# EAGLE design pcb-meter (EAGLE 7.4.0)
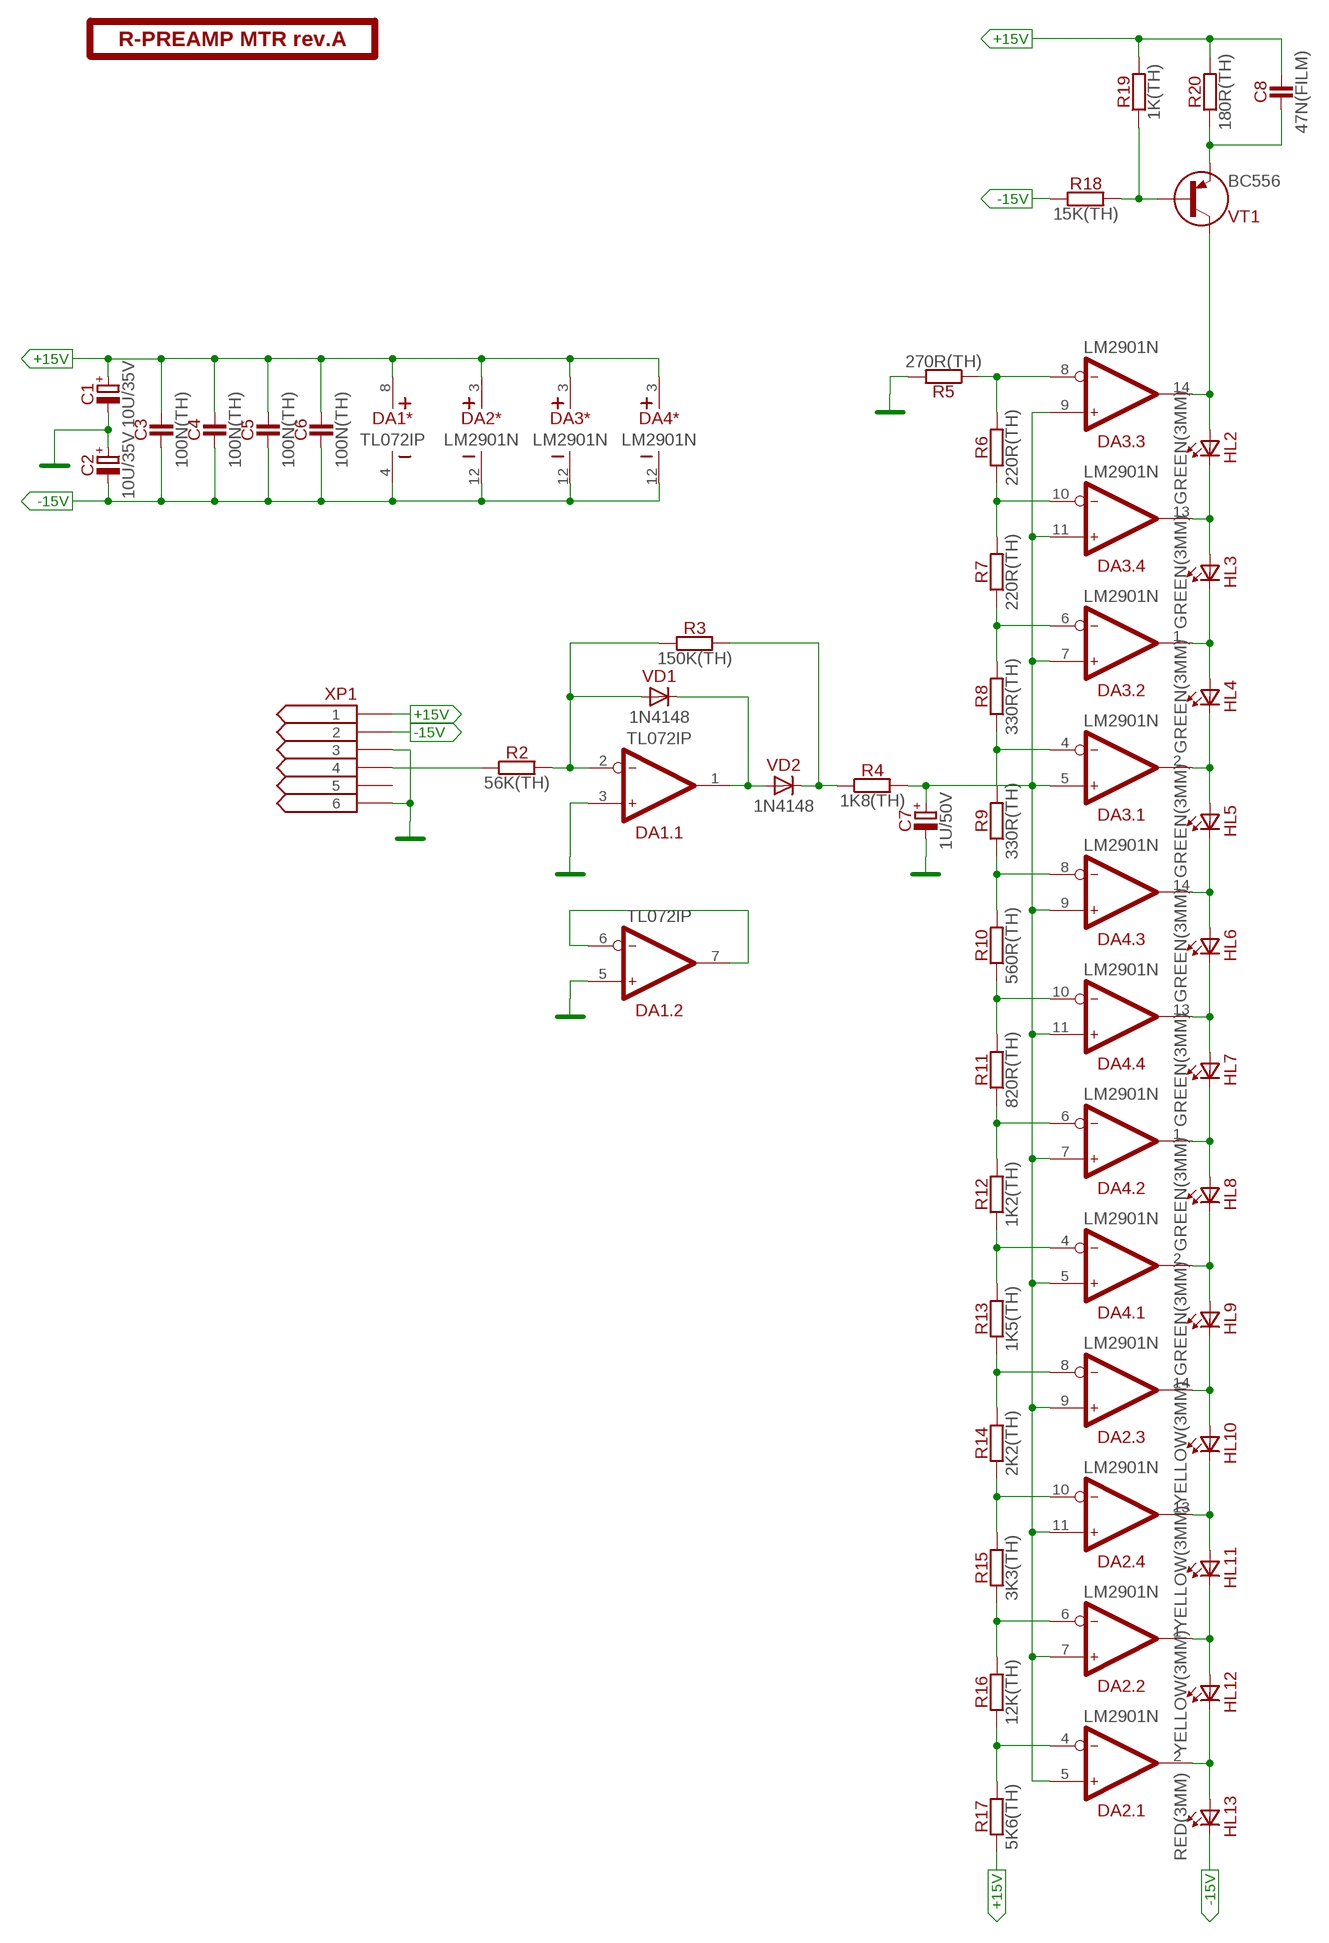
[diagram p0: schematic, sheet 1]

## Parts
C1  10U/35V  [E2-5]
C2  10U/35V  [E2-5]
C3  100N(TH)  [C050-024X044]
C4  100N(TH)  [C050-024X044]
C5  100N(TH)  [C050-024X044]
C6  100N(TH)  [C050-024X044]
C7  1U/50V  [E1,5-4]
C8  47N(FILM)  [C050-025X075]
DA1  TL072IP  [DIP-8]
DA2  LM2901N  [DIP-14]
DA3  LM2901N  [DIP-14]
DA4  LM2901N  [DIP-14]
HL2  GREEN(3MM)  [LED3MM-H]
HL3  GREEN(3MM)  [LED3MM-H]
HL4  GREEN(3MM)  [LED3MM-H]
HL5  GREEN(3MM)  [LED3MM-H]
HL6  GREEN(3MM)  [LED3MM-H]
HL7  GREEN(3MM)  [LED3MM-H]
HL8  GREEN(3MM)  [LED3MM-H]
HL9  GREEN(3MM)  [LED3MM-H]
HL10  YELLOW(3MM)  [LED3MM-H]
HL11  YELLOW(3MM)  [LED3MM-H]
HL12  YELLOW(3MM)  [LED3MM-H]
HL13  RED(3MM)  [LED3MM-H]
PCB1  R-PREAMP MTR rev.A  GENERIC-LOGO  [F-LOGO]
R2  56K(TH)  [R-0207/10]
R3  150K(TH)  [R-0207/10]
R4  1K8(TH)  [R-0207/10]
R5  270R(TH)  [R-0207/10]
R6  220R(TH)  [R-0207/10]
R7  220R(TH)  [R-0207/10]
R8  330R(TH)  [R-0207/10]
R9  330R(TH)  [R-0207/10]
R10  560R(TH)  [R-0207/10]
R11  820R(TH)  [R-0207/10]
R12  1K2(TH)  [R-0207/10]
R13  1K5(TH)  [R-0207/10]
R14  2K2(TH)  [R-0207/10]
R15  3K3(TH)  [R-0207/10]
R16  12K(TH)  [R-0207/10]
R17  5K6(TH)  [R-0207/10]
R18  15K(TH)  [R-0207/10]
R19  1K(TH)  [R-0207/10]
R20  180R(TH)  [R-0207/10]
VD1  1N4148  [DO35-7]
VD2  1N4148  [DO35-7]
VT1  BC556  [TO92]
XP1  CONN-6-NORMAL  [MA03-2]

## Nets
+15V: C1.+ C3.2 C4.2 C5.2 C6.2 C8.2 DA1.8(*:V+) DA2.3(*:V+) DA3.3(*:V+) DA4.3(*:V+) R17.1 R19.2 R20.2 XP1.1
-15V: C2.- C3.1 C4.1 C5.1 C6.1 DA1.4(*:V-) DA2.12(*:V-) DA3.12(*:V-) DA4.12(*:V-) HL13.K(C) R18.1 XP1.2
GND: C1.- C2.+ C7.- DA1.3(.1:IN+) DA1.5(.2:IN+) R5.2 XP1.3 XP1.6
N$2: R2.1 XP1.4
N$5: DA1.2(.1:IN-) R2.2 R3.1 VD1.A
N$6: R18.2 R19.1 VT1.2(B)
N$7: DA1.1(.1:OUT) VD1.C VD2.A
N$8: R3.2 R4.1 VD2.C
N$10: C8.1 R20.1 VT1.3(E)
N$11: DA2.4(.1:IN-) R16.1 R17.2
N$12: DA2.6(.2:IN-) R15.1 R16.2
N$13: DA2.10(.4:IN-) R14.1 R15.2
N$14: DA2.2(.1:OUT) HL12.K(C) HL13.A
N$15: DA2.1(.2:OUT) HL11.K(C) HL12.A
N$16: DA2.13(.4:OUT) HL10.K(C) HL11.A
N$17: DA2.14(.3:OUT) HL9.K(C) HL10.A
N$18: DA4.2(.1:OUT) HL8.K(C) HL9.A
N$19: DA4.1(.2:OUT) HL7.K(C) HL8.A
N$20: DA4.13(.4:OUT) HL6.K(C) HL7.A
N$21: DA4.14(.3:OUT) HL5.K(C) HL6.A
N$22: DA3.2(.1:OUT) HL4.K(C) HL5.A
N$23: DA3.1(.2:OUT) HL3.K(C) HL4.A
N$24: DA3.13(.4:OUT) HL2.K(C) HL3.A
N$25: DA3.14(.3:OUT) HL2.A VT1.1(C)
N$26: C7.+ DA2.5(.1:IN+) DA2.7(.2:IN+) DA2.9(.3:IN+) DA2.11(.4:IN+) DA3.5(.1:IN+) DA3.7(.2:IN+) DA3.9(.3:IN+) DA3.11(.4:IN+) DA4.5(.1:IN+) DA4.7(.2:IN+) DA4.9(.3:IN+) DA4.11(.4:IN+) R4.2
N$27: DA2.8(.3:IN-) R13.1 R14.2
N$28: DA4.4(.1:IN-) R12.1 R13.2
N$29: DA4.6(.2:IN-) R11.1 R12.2
N$30: DA4.10(.4:IN-) R10.1 R11.2
N$31: DA4.8(.3:IN-) R9.1 R10.2
N$32: DA3.4(.1:IN-) R8.1 R9.2
N$33: DA3.6(.2:IN-) R7.1 R8.2
N$34: DA3.10(.4:IN-) R6.1 R7.2
N$35: DA3.8(.3:IN-) R5.1 R6.2
N$36: DA1.6(.2:IN-) DA1.7(.2:OUT)
Unconnected: XP1.5

## Library data of the parts
C1 C2 = capacitors-electrolytic:?; MOUSER: 647-USW1V100MDD
C3-C6 = capacitors:?; MOUSER: 81-RCER71H104K0A2H3B
C7 = capacitors-electrolytic:?; MOUSER: 647-USW1H010MDD
C8 = capacitors:?; MOUSER: 871-B32529C1473J
DA1 = ic-ti:TL072; MOUSER: 595-TL072IP
DA2-DA4 = ic-fairchild:LM2901; MOUSER: 512-LM2901N
HL2-HL9 = optoelectronics:?(3MM); MOUSER: 696-SSL-LX3044PGD
HL10-HL12 = optoelectronics:?(3MM); MOUSER: 638-264-7YD
HL13 = optoelectronics:?(3MM); MOUSER: 696-SSL-LX3044ID
PCB1 = module-footprints:GENERIC
R2-R12 R14-R18 R20 = resistors:?
R13 = resistors:?; MOUSER: 71-CCF071K50GKE36
R19 = resistors:?; MOUSER: 71-RN55D-F-1.0K
VD1 VD2 = diodes:?; MOUSER: 583-1N4148-T
VT1 = transistors-pnp:?
XP1 = connectors:CONN-6-?

## Board
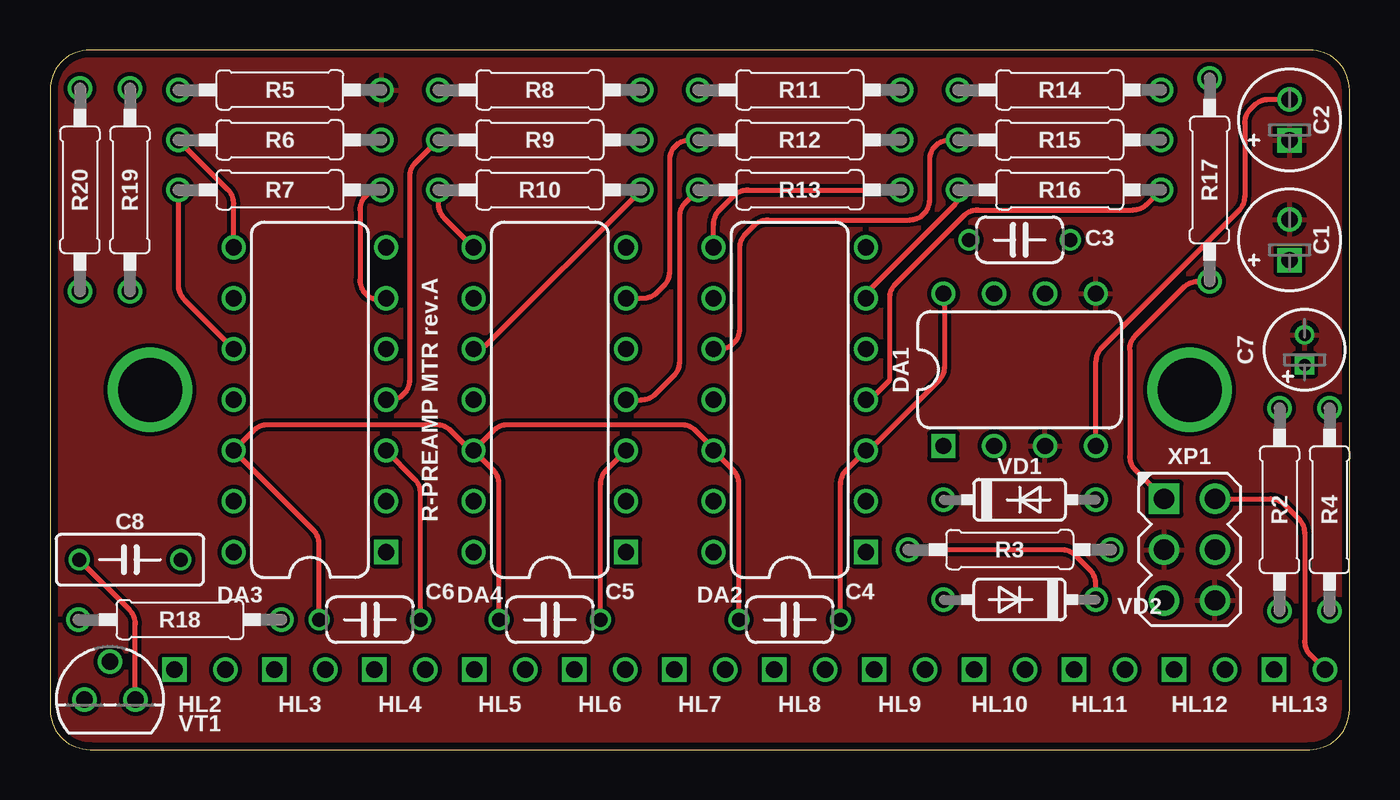
[diagram p1: board, top side]
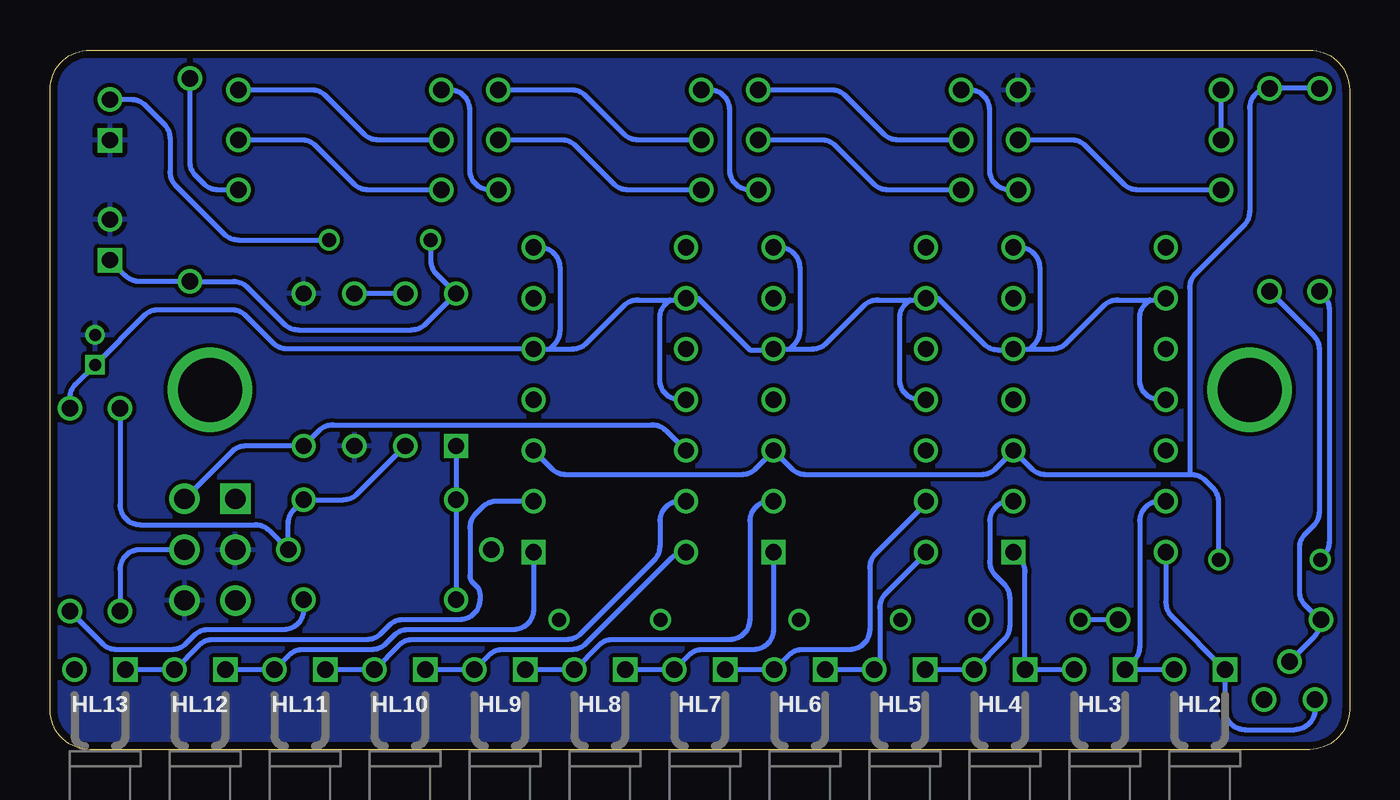
[diagram p2: board, bottom side, seen from below]

Size 65 x 35 mm. Coordinates in mm from the lower left corner, seen from the top.
Outline: 0,33 0,2 arc90 2,0 63,0 arc90 65,2 65,33 arc90 63,35 2,35 arc90 0,33
Copper layers (1*16): Top 0.0356mm / dielectric 1.5011mm / Bottom 0.0356mm
Design rules "fluorumlabs": minimum track width 6mil, minimum drill 13mil, track to track 8mil, track to pad 8mil, pad to pad 6mil, via to via 6mil, smd to smd 6mil, copper to edge 15mil, drill to drill 6mil, minimum pad ring 7mil, minimum via ring 7mil, stop-mask expansion 3mil, vias tented up to drill 25mil, thermal gap 10mil

### Footprints (pad centres in the part's own frame; a part is rotated, then mirrored left to right if it is on the bottom)
E2-5 = drill 0.813 square: + -1.016,0 | drill 0.813: - 1.016,0
C050-024X044 = drill 0.7: 1 -2.54,0; 2 2.54,0
E1,5-4 = drill 0.6 square: + -0.75,0 | drill 0.6: - 0.75,0
C050-025X075 = drill 0.7: 1 -2.54,0; 2 2.54,0
DIP-8 = drill 0.813 square: 1 -3.81,-3.81 | drill 0.813: 2 -1.27,-3.81; 3 1.27,-3.81; 4 3.81,-3.81; 5 3.81,3.81; 6 1.27,3.81; 7 -1.27,3.81; 8 -3.81,3.81
DIP-14 = drill 0.813 square: 1 -7.62,-3.81 | drill 0.813: 2 -5.08,-3.81; 3 -2.54,-3.81; 4 0,-3.81; 5 2.54,-3.81; 6 5.08,-3.81; 7 7.62,-3.81; 8 7.62,3.81; 9 5.08,3.81; 10 2.54,3.81; 11 0,3.81; 12 -2.54,3.81; 13 -5.08,3.81; 14 -7.62,3.81
LED3MM-H = drill 0.813 square: A -1.27,0 | drill 0.813: K 1.27,0
R-0207/10 = drill 0.813: 1 -5.08,0; 2 5.08,0
DO35-7 = drill 0.813: A 3.81,0; C -3.81,0
TO92 = drill 0.813: 1 -1.27,0; 2 0,1.905; 3 1.27,0
MA03-2 = drill 1.016 square: 1 -2.54,-1.27 | drill 1.016: 2 -2.54,1.27; 3 0,-1.27; 4 0,1.27; 5 2.54,-1.27; 6 2.54,1.27

### Placement (x,y rotation side)
C1  62,25.5 90 top
C2  62,31.5 90 top
C3  48.5,25.5 180 top
C4  37,6.5 0 top
C5  25,6.5 0 top
C6  16,6.5 0 top
C7  62.75,20 90 top
C8  4,9.5 0 top
DA1  48.5,19 0 top
DA2  37,17.5 90 top
DA3  13,17.5 90 top
DA4  25,17.5 90 top
HL2  7.5,4 180 bottom
HL3  12.5,4 180 bottom
HL4  17.5,4 180 bottom
HL5  22.5,4 180 bottom
HL6  27.5,4 180 bottom
HL7  32.5,4 180 bottom
HL8  37.5,4 180 bottom
HL9  42.5,4 180 bottom
HL10  47.5,4 180 bottom
HL11  52.5,4 180 bottom
HL12  57.5,4 180 bottom
HL13  62.5,4 180 bottom
PCB1  19,17.5 270 top
R2  61.5,12 90 top
R3  48,10 180 top
R4  64,12 90 top
R5  11.5,33 0 top
R6  11.5,30.5 180 top
R7  11.5,28 180 top
R8  24.5,33 180 top
R9  24.5,30.5 180 top
R10  24.5,28 180 top
R11  37.5,33 180 top
R12  37.5,30.5 180 top
R13  37.5,28 180 top
R14  50.5,33 180 top
R15  50.5,30.5 180 top
R16  50.5,28 180 top
R17  58,28.5 90 top
R18  6.5,6.5 180 top
R19  4,28 90 top
R20  1.5,28 90 top
VD1  48.5,12.5 0 top
VD2  48.5,7.5 180 top
VT1  3,2.5 0 top
XP1  57,10 270 top

### Tracks (layer width: path | path; a pad name or v marks a point on that pad's centre or on a via)
+15V
  Top 0.254: C4.2 39.54,13.28 arc-45 39.83,13.98 DA2.3 40.96,14.96 44.46,18.46 arc45 44.75,19.16 44.75,22.75 DA1.8 | C5.2 27.54,13.28 arc-45 27.83,13.98 DA4.3 | C6.2 18.54,12.82 arc45 18.25,13.52 DA3.3 | XP1.1 54.29,13.98 arc-45 54,14.68 54,20.01 arc-45 54.29,20.71 56.71,23.13 arc-45 57.41,23.42 R17.1
  Bottom 0.254: C3.2 45.96,24.49 arc-45 45.67,23.79 DA1.8 46.21,21.29 arc45 46.91,21 52.59,21 arc45 53.29,21.29 55.13,23.13 arc-45 55.83,23.42 R17.1 60.52,23.42 arc45 61.23,23.71 C1.+ | R20.2 R19.2 arc-90 5,32.08 5,26.91 arc45 5.29,26.21 7.71,23.79 arc-45 8,23.09 8,13.75 | DA2.3 39.89,14.04 arc-45 39.19,13.75 30.41,13.75 arc-45 29.71,14.04 28.81,14.94 DA4.3 27.89,14.04 arc-45 27.19,13.75 18.41,13.75 arc-45 17.71,14.04 16.81,14.94 DA3.3 15.89,14.04 arc-45 15.19,13.75 8,13.75 | C8.2 6.54,12.38 arc-45 6.83,13.08 7.21,13.46 arc-45 7.91,13.75 8,13.75
-15V
  Top 0.254: C4.1 34.46,13.28 arc45 34.17,13.98 DA2.12 33.19,15.06 32.29,15.96 arc45 31.59,16.25 22.89,16.25 arc45 22.19,15.96 DA4.12 | C5.1 22.46,13.28 arc45 22.17,13.98 DA4.12 | C6.1 13.46,10.28 arc45 13.17,10.98 DA3.12 10.19,15.96 arc-45 10.89,16.25 19.34,16.25 arc-45 20.04,15.96 21.04,14.96 DA4.12 | C2.- 60.93,32.52 arc45 60.22,32.22 60.04,32.04 arc45 59.75,31.34 59.75,27.66 arc-45 59.46,26.96 52.6,20.1 arc45 52.31,19.4 DA1.4 | XP1.2 61.05,12.54 arc-45 61.75,12.25 62.46,11.54 arc-45 62.75,10.84 62.75,5.43 arc45 63.04,4.73 HL13.K
  Bottom 0.254: C3.1 55.59,25.5 arc45 56.29,25.79 58.71,28.21 arc45 59,28.91 59,30.59 arc-45 59.29,31.29 60.22,32.22 arc-45 60.93,32.52 C2.- | DA2.12 34.19,15.96 arc-45 34.89,16.25 50.84,16.25 arc-45 51.54,15.96 DA1.4 55.21,15.19 arc-45 55.91,14.9 XP1.2 | R18.1 C6.1
GND
  pour Bottom: 0,35 65,35 65,0 0,0
  pour Top: 0,35 65,35 65,0 0,0
N$2
  Bottom 0.254: XP1.4 60.5,10 arc-90 61.5,9 R2.1
N$3  (via drill 3.2)
  other vias: 57,18
N$4  (via drill 3.2)
  other vias: 5,18
N$5
  Bottom 0.254: DA1.2 49.63,12.79 arc45 50.33,12.5 VD1.A 52.79,12.02 arc-45 53.08,11.32 R3.1 54.04,10.96 arc-45 54.74,11.25 60.5,11.25 arc90 61.5,12.25 R2.2
N$6
  Bottom 0.254: R18.2 1.5,6.5 | 1.5,6.5 2.21,7.21 arc45 2.5,7.91 2.5,10.09 arc45 2.21,10.79 1.79,11.21 arc-45 1.5,11.91 1.5,20.01 arc-45 1.79,20.71 R19.1 | 1.5,6.5 1.5,6.32 arc45 1.79,5.61 VT1.2
N$7
  Bottom 0.254: DA1.1 VD1.C VD2.A
N$8
  Top 0.254: VD2.C 52.31,8.28 arc45 52.02,8.98 51.29,9.71 arc45 50.59,10 R3.2
  Bottom 0.254: VD2.C 52.31,7 arc90 53.31,6 57.09,6 arc-45 57.79,5.71 58.21,5.29 arc45 58.91,5 61.67,5 arc45 62.37,5.29 R4.1
N$10
  Top 0.254: VT1.3 4.27,6.28 arc45 3.98,6.98 C8.1
  Bottom 0.254: C8.1 1.46,9.54 1.29,9.71 arc-45 1,10.41 1,22.01 arc-45 1.29,22.71 R20.1
N$11
  Top 0.254: DA2.4 41,17.5 42,18.5 42,22.59 arc-45 42.29,23.29 45.71,26.71 arc-45 46.41,27 54.17,27 arc45 54.87,27.29 R16.1
  Bottom 0.254: R16.1 56.59,28 arc45 57.29,28.29 57.71,28.71 arc45 58,29.41 R17.2
N$12
  Top 0.254: DA2.6 40.81,22.81 45.21,27.21 arc45 45.5,27.91 45.5,27.92 R16.2
  Bottom 0.254: R16.2 49.09,28 arc45 49.79,28.29 51.71,30.21 arc-45 52.41,30.5 R15.1
N$13
  Top 0.254: DA2.10 33.5,20.04 arc90 34.5,21.04 34.5,25.09 arc-45 34.79,25.79 35.21,26.21 arc-45 35.91,26.5 43,26.5 arc90 44,27.5 44,29.5 arc-90 45,30.5 R15.2
  Bottom 0.254: R15.2 48.59,30.5 arc45 49.29,30.79 51.21,32.71 arc-45 51.91,33 R14.1
N$14
  Bottom 0.254: HL13.A HL12.K 57.56,5.21 arc45 56.86,5.5 49.16,5.5 arc-45 48.46,5.79 48.04,6.21 arc45 47.34,6.5 44.5,6.5 arc-90 43.5,7.5 43.5,7.79 arc-45 43.65,8.15 43.85,8.35 arc45 44,8.71 44,11.09 arc45 43.71,11.79 43.37,12.13 arc45 42.67,12.42 DA2.2
N$15
  Bottom 0.254: HL12.A HL11.K 53.06,4.71 arc45 52.36,5 48.91,5 arc-45 48.21,5.29 47.79,5.71 arc45 47.09,6 41.81,6 arc-90 40.81,7 DA2.1
N$16
  Bottom 0.254: HL11.A HL10.K 47.56,5.21 arc45 46.86,5.5 39.16,5.5 arc-45 38.46,5.79 34.79,9.46 arc-45 34.5,10.16 34.5,11.42 arc90 33.5,12.42 DA2.13
N$17
  Bottom 0.254: HL10.A HL9.K 43.06,4.71 arc45 42.36,5 38.91,5 arc-45 38.21,5.29 33.91,9.59 arc45 33.21,9.88 DA2.14
N$18
  Bottom 0.254: HL9.A HL8.K 37.56,5.21 arc45 36.86,5.5 31,5.5 arc-90 30,6.5 30,11.42 arc90 29,12.42 DA4.2
N$19
  Bottom 0.254: HL8.A HL7.K 33.06,4.71 arc45 32.36,5 29.81,5 arc-90 28.81,6 DA4.1
N$20
  Bottom 0.254: HL7.A HL6.K 28.06,4.71 arc45 27.36,5 25,5 arc-90 24,6 24,9.09 arc45 23.71,9.79 21.19,12.31 DA4.13
N$21
  Bottom 0.254: HL6.A HL5.K 23.5,4.27 23.5,7.09 arc45 23.21,7.79 21.19,9.81 DA4.14
N$22
  Bottom 0.254: HL5.A HL4.K 17.29,5.48 arc-45 17,6.18 17,7.59 arc-45 17.29,8.29 17.71,8.71 arc45 18,9.41 18,11.42 arc90 17,12.42 DA3.2
N$23
  Bottom 0.254: HL3.K HL4.A 16.23,8.89 arc-45 16.52,9.59 DA3.1
N$24
  Bottom 0.254: DA3.13 9.5,12.42 arc-90 10.5,11.42 10.5,5.14 arc45 10.79,4.44 HL3.A HL2.K
N$25
  Bottom 0.254: DA3.14 9.19,7.37 arc-45 8.9,6.67 HL2.A 6.23,2 arc-90 5.23,1 2.73,1 arc-90 1.73,2 VT1.1
N$26
  Bottom 0.254: 28,20.04 DA4.5 28.85,20 30,20 32.58,22.58 DA2.9 33.27,22.5 34,22.5 | 28,20.04 26.87,20.04 arc-45 26.17,20.33 24.29,22.21 arc45 23.59,22.5 22,22.5 | 22,22.5 21.27,22.5 DA4.9 20.58,22.58 18.29,20.29 arc-45 17.59,20 16.85,20 DA3.5 16,20.04 | 16,20.04 14.87,20.04 arc-45 14.17,20.33 12.29,22.21 arc45 11.59,22.5 10,22.5 | 10,22.5 9.27,22.5 DA3.9 | 40,20.04 DA2.5 53.13,20.04 arc45 53.83,20.33 55.21,21.71 arc-45 55.91,22 59.59,22 arc-45 60.29,21.71 C7.+ 63.71,18.29 arc-45 64,17.59 R4.2 | 40,20.04 38.87,20.04 arc-45 38.17,20.33 36.29,22.21 arc45 35.59,22.5 34,22.5 | DA3.11 9.5,17.5 arc90 10.5,18.5 10.5,21.59 arc45 10.21,22.29 10,22.5 | DA3.7 16.5,25.12 arc90 15.5,24.12 15.5,20.95 arc45 15.79,20.25 16,20.04 | DA4.11 21.5,17.5 arc90 22.5,18.5 22.5,21.59 arc45 22.21,22.29 22,22.5 | DA4.7 28.5,25.12 arc90 27.5,24.12 27.5,20.95 arc45 27.79,20.25 28,20.04 | DA2.11 33.5,17.5 arc90 34.5,18.5 34.5,21.59 arc45 34.21,22.29 34,22.5 | DA2.7 40.5,25.12 arc90 39.5,24.12 39.5,20.95 arc45 39.79,20.25 40,20.04
N$27
  Top 0.254: DA2.8 33.19,26.28 arc-45 33.48,26.98 34.21,27.71 arc-45 34.91,28 R13.1
  Bottom 0.254: R13.1 43,28 arc90 44,29 44,32 arc-90 45,33 R14.2
N$28
  Top 0.254: DA4.4 29.59,17.5 arc45 30.29,17.79 31.21,18.71 arc45 31.5,19.41 31.5,26.67 arc-45 31.79,27.37 R13.2
  Bottom 0.254: R13.2 36.09,28 arc45 36.79,28.29 38.71,30.21 arc-45 39.41,30.5 R12.1
N$29
  Top 0.254: DA4.6 29.67,22.58 arc45 30.37,22.87 30.71,23.21 arc45 31,23.91 31,29.5 arc-90 32,30.5 R12.2
  Bottom 0.254: R12.2 35.59,30.5 arc45 36.29,30.79 38.21,32.71 arc-45 38.91,33 R11.1
N$30
  Top 0.254: DA4.10 21.21,20.04 arc45 21.91,20.33 R10.1
  Bottom 0.254: R10.1 30,28 arc90 31,29 31,32 arc-90 32,33 R11.2
N$31
  Top 0.254: R10.2 19.42,27.3 arc45 19.71,26.6 DA4.8
  Bottom 0.254: R10.2 23.09,28 arc45 23.79,28.29 25.71,30.21 arc-45 26.41,30.5 R9.1
N$32
  Top 0.254: DA3.4 17,17.5 arc90 18,18.5 18,28.67 arc-45 18.29,29.37 R9.2
  Bottom 0.254: R9.2 22.59,30.5 arc45 23.29,30.79 25.21,32.71 arc-45 25.91,33 R8.1
N$33
  Top 0.254: R7.1 16.5,28 arc90 15.5,27 15.5,23.5 arc90 16.5,22.5 16.73,22.5 DA3.6
  Bottom 0.254: R7.1 17,28 arc90 18,29 18,32 arc-90 19,33 R8.2
N$34
  Top 0.254: R7.2 6.42,23.22 arc45 6.71,22.52 DA3.10
  Bottom 0.254: R7.2 10.59,28 arc45 11.29,28.29 13.21,30.21 arc-45 13.91,30.5 R6.1
N$35
  Top 0.254: DA3.8 9.19,27.32 arc45 8.9,28.02 R6.2
  Bottom 0.254: R6.2 R5.1
N$36
  Bottom 0.254: DA1.7 DA1.6